# EAGLE design mux (EAGLE 9.6.2)
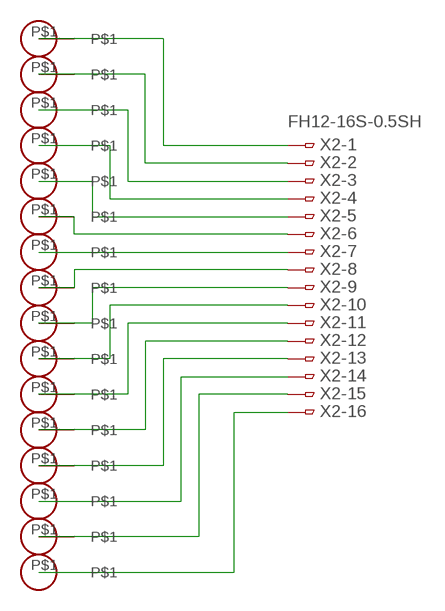
[diagram p0: schematic, sheet 1]

## Parts
U$1  PADPAD  [PAD]
U$2  PADPAD  [PAD]
U$3  PADPAD  [PAD]
U$4  PADPAD  [PAD]
U$5  PADPAD  [PAD]
U$6  PADPAD  [PAD]
U$7  PADPAD  [PAD]
U$8  PADPAD  [PAD]
U$9  PADPAD  [PAD]
U$10  PADPAD  [PAD]
U$11  PADPAD  [PAD]
U$12  PADPAD  [PAD]
U$13  PADPAD  [PAD]
U$14  PADPAD  [PAD]
U$15  PADPAD  [PAD]
U$16  PADPAD  [PAD]
X2  FH12-16S-0.5SH  [FH12-16S-0.5SH]

## Nets
N$1: U$1.P$1 X2.1
N$2: U$2.P$1 X2.2
N$3: U$3.P$1 X2.3
N$4: U$4.P$1 X2.4
N$5: U$5.P$1 X2.5
N$6: U$6.P$1 X2.6
N$7: U$7.P$1 X2.7
N$8: U$8.P$1 X2.8
N$9: U$9.P$1 X2.9
N$10: U$10.P$1 X2.10
N$11: U$11.P$1 X2.11
N$12: U$12.P$1 X2.12
N$13: U$13.P$1 X2.13
N$14: U$14.P$1 X2.14
N$15: U$15.P$1 X2.15
N$16: U$16.P$1 X2.16

## Library data of the parts
U$1-U$16 = pad:PAD
X2 = con-hirose:FH12-16S-0.5S: 0.5mm Pitch Connectors For FPC/FFC Source: Data sheet <http://www.hirose.co.jp/cataloge_hp/e58605370.pdf>; MPN: FH12-16S-0.5SH(55); OC_FARNELL: 1324546; OC_NEWARK: 34M6162

## Board
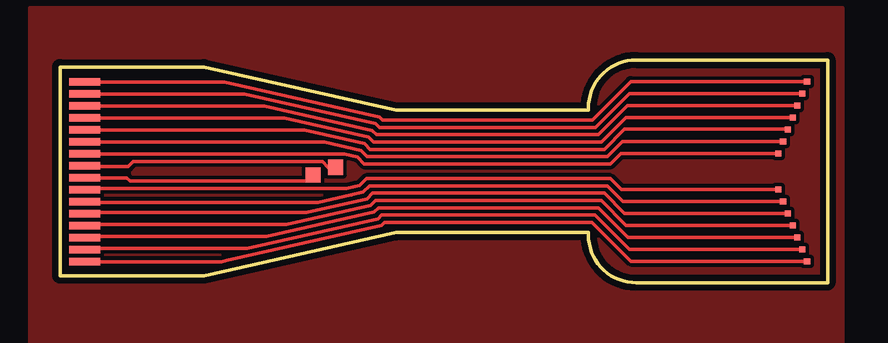
[diagram p1: board, top side]
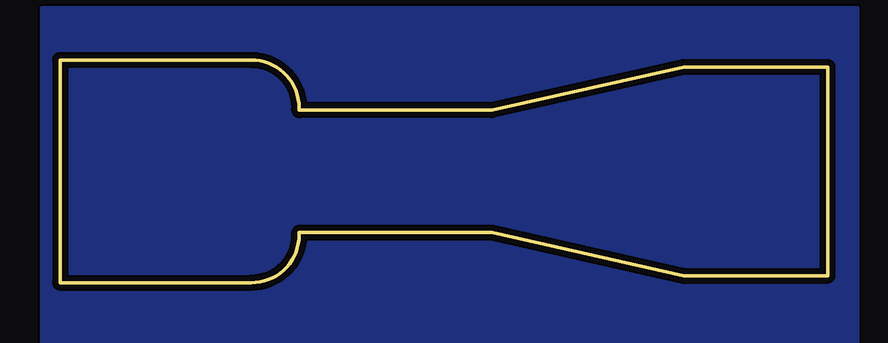
[diagram p2: board, bottom side, seen from below]

Size 32 x 9.3 mm. Coordinates in mm from the lower left corner, seen from the top.
Outline: 22.03,2 22.03,2.1 14,2.1 6,0.3 0,0.3 0,9 6,9 14,7.2 22.03,7.2 22.03,7.3 arc-90 24.03,9.3 32,9.3 32,0 24.03,0 arc-90 22.03,2
Copper layers (1*16): Top 0.035mm / dielectric 1.5mm / Bottom 0.035mm
Design rules "default *": minimum track width 6mil, minimum drill 0.35mm, track to track 6mil, track to pad 6mil, pad to pad 6mil, via to via 6mil, smd to smd 6mil, copper to edge 10mil, drill to drill 6mil, minimum pad ring 10mil, minimum via ring 8mil, stop-mask expansion 4mil, vias tented up to drill 0mil, thermal gap 10mil

### Footprints (pad centres in the part's own frame; a part is rotated, then mirrored left to right if it is on the bottom)
PAD = smd 0.254 x 0.254: P$1 0,0
PAD' = smd 0.635 x 0.635: P$1 0,0
FH12-16S-0.5SH = smd 0.3 x 1.3: 1 -3.75,3.25; 2 -3.25,3.25; 3 -2.75,3.25; 4 -2.25,3.25; 5 -1.75,3.25; 6 -1.25,3.25; 7 -0.75,3.25; 8 -0.25,3.25; 9 0.25,3.25; 10 0.75,3.25; 11 1.25,3.25; 12 1.75,3.25; 13 2.25,3.25; 14 2.75,3.25; 15 3.25,3.25; 16 3.75,3.25

### Placement (x,y rotation side)
U$1  31.14,0.9 0 top
U$2  30.94,1.4 0 top
U$3  30.75,1.9 0 top
U$4  30.55,2.4 0 top
U$5  30.35,2.9 0 top
U$6  30.15,3.39 0 top
U$7  29.95,3.89 0 top
U$8  PADPAD  [PAD']  10.55,4.5 0 top
U$9  PADPAD  [PAD']  11.49,4.82 0 top
U$10  29.95,5.39 0 top
U$11  30.15,5.89 0 top
U$12  30.35,6.39 0 top
U$13  30.55,6.89 0 top
U$14  30.75,7.39 0 top
U$15  30.94,7.89 0 top
U$16  31.14,8.39 0 top
X2  4.28,4.63 90 top

### Tracks (layer width: path | path; a pad name or v marks a point on that pad's centre or on a via)
GND
  pour Top: -1.27,11.48 -1.27,-3 32.64,-3 32.64,11.48
  pour Bottom: -1.27,11.48 -1.27,-3.51 32.77,-3.51 32.77,11.48
N$1
  Top 0.152: U$1.P$1 23.81,0.9 22.19,2.52 13.53,2.52 13.41,2.39 6.95,0.94 6.94,0.93 6.73,0.88 X2.1
N$2
  Top 0.152: X2.2 1.09,1.44 7.79,1.44 13.25,2.67 13.41,2.82 22.31,2.82 23.74,1.4 U$2.P$1
N$3
  Top 0.152: X2.3 1.09,1.94 8.62,1.94 13.1,2.95 13.28,3.13 22.44,3.13 23.67,1.9 U$3.P$1
N$4
  Top 0.152: X2.4 1.09,2.44 9.45,2.44 12.95,3.23 13.15,3.43 22.57,3.43 23.6,2.4 U$4.P$1
N$5
  Top 0.152: X2.5 1.09,2.94 2.93,2.94 2.94,2.94 10.29,2.94 12.79,3.5 13.03,3.74 22.69,3.74 23.53,2.9 U$5.P$1
N$6
  Top 0.152: U$6.P$1 23.47,3.39 22.82,4.04 12.9,4.04 12.64,3.78 12.11,3.66 | X2.6 1.05,3.36 10.77,3.36 12.11,3.66 | 12.11,3.66 | 12.11,3.66 12.15,3.67 12.11,3.66
N$7
  Top 0.152: X2.7 1.09,3.94 11.95,3.94 12.29,4.02 12.49,4.06 12.78,4.35 22.94,4.35 23.4,3.89 U$7.P$1
N$8
  Top 0.152: X2.8 2.79,4.38 2.93,4.25 10.3,4.25 U$8.P$1
N$9
  Top 0.152: U$9.P$1 11.18,4.82 10.94,5.06 3.06,5.06 2.85,4.85 1.06,4.85 X2.9
N$10
  Top 0.152: X2.10 1.04,5.37 11.86,5.37 12.4,5.25 12.68,4.96 22.95,4.96 23.38,5.39 U$10.P$1
N$11
  Top 0.152: X2.11 1.04,5.87 11.03,5.87 12.55,5.52 12.81,5.26 22.82,5.26 23.45,5.89 23.46,5.89 U$11.P$1
N$12
  Top 0.152: X2.12 1.04,6.37 10.19,6.37 12.7,5.8 12.94,5.57 22.7,5.57 23.54,6.41 30.33,6.41 U$12.P$1
N$13
  Top 0.152: X2.13 1.04,6.87 9.36,6.87 12.86,6.08 13.06,5.87 22.57,5.87 23.59,6.89 U$13.P$1
N$14
  Top 0.152: X2.14 1.04,7.37 8.53,7.37 13.01,6.36 13.19,6.18 22.45,6.18 23.65,7.39 U$14.P$1
N$15
  Top 0.152: X2.15 1.04,7.87 7.69,7.87 13.16,6.64 13.31,6.48 22.32,6.48 23.74,7.9 23.76,7.89 U$15.P$1
N$16
  Top 0.152: X2.16 1.04,8.37 6.86,8.37 13.31,6.92 13.44,6.79 22.19,6.79 23.8,8.4 U$16.P$1